# Altium schematic sheet Additional Breakout.SchDoc: Additional Digital IO
size A; DrawnBy: Adam Vadala-Roth; DocumentNumber: 9; Revision: 2.4b; SheetNumber: 9; SheetTotal: 9
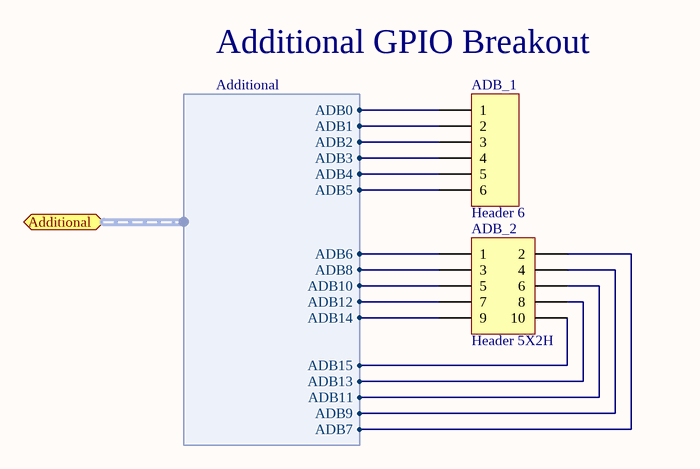
[diagram p0: Additional Breakout.SchDoc]

## Parts
ADB_1  Header 6  [HDR1X6]
ADB_2  Header 5X2H  [HDR2X5H]

## Ports
Additional (harness Additional)

## Harnesses
Additional: ADB0, ADB1, ADB2, ADB3, ADB4, ADB6, ADB5, ADB7, ADB9, ADB8, ADB10, ADB11, ADB12, ADB13, ADB14, ADB15

## Nets
NetADB_1_1: ADB_1.1 ; port Additional.ADB0
NetADB_1_2: ADB_1.2 ; port Additional.ADB1
NetADB_1_3: ADB_1.3 ; port Additional.ADB2
NetADB_1_4: ADB_1.4 ; port Additional.ADB3
NetADB_1_5: ADB_1.5 ; port Additional.ADB4
NetADB_1_6: ADB_1.6 ; port Additional.ADB5
NetADB_2_1: ADB_2.1 ; port Additional.ADB6
NetADB_2_2: ADB_2.2 ; port Additional.ADB7
NetADB_2_3: ADB_2.3 ; port Additional.ADB8
NetADB_2_4: ADB_2.4 ; port Additional.ADB9
NetADB_2_5: ADB_2.5 ; port Additional.ADB10
NetADB_2_6: ADB_2.6 ; port Additional.ADB11
NetADB_2_7: ADB_2.7 ; port Additional.ADB12
NetADB_2_8: ADB_2.8 ; port Additional.ADB13
NetADB_2_9: ADB_2.9 ; port Additional.ADB14
NetADB_2_10: ADB_2.10 ; port Additional.ADB15

## Notes on the sheet
- (near ADB_1) Additional GPIO Breakout

## Library data of the parts
ADB_1 = Header 6: Header, 6-Pin; LatestRevisionDate: 17-Jul-2002; LatestRevisionNote: Re-released for DXP Platform.; Publisher: Altium Limited
ADB_2 = Header 5X2H: Header, 5-Pin, Dual row, Right Angle; LatestRevisionDate: 17-Jul-2002; LatestRevisionNote: Re-released for DXP Platform.; Publisher: Altium Limited